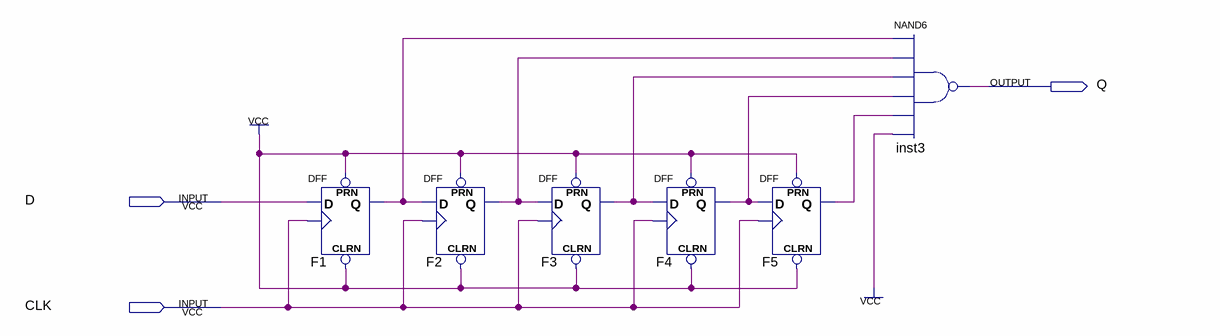
[diagram p0: schematic sheet]
// Quartus schematic debounce.bdf as structural Verilog: 6 symbols, 3 pins
module debounce (
  input  D,
  input  CLK,
  output Q
);

  wire F1_q, F2_q, F3_q, F4_q, F5_q;

  DFF F1 (.CLRN(1'b1), .CLK(CLK), .D(D), .PRN(1'b1), .Q(F1_q));
  DFF F2 (.CLRN(1'b1), .CLK(CLK), .D(F1_q), .PRN(1'b1), .Q(F2_q));
  DFF F3 (.CLRN(1'b1), .CLK(CLK), .D(F2_q), .PRN(1'b1), .Q(F3_q));
  DFF F4 (.CLRN(1'b1), .CLK(CLK), .D(F3_q), .PRN(1'b1), .Q(F4_q));
  DFF F5 (.CLRN(1'b1), .CLK(CLK), .D(F4_q), .PRN(1'b1), .Q(F5_q));
  nand inst3 (Q, F1_q, F2_q, F3_q, F4_q, F5_q, 1'b1);
endmodule
